# Altium project 19052025_ChanNuoiThongMinh.PrjPcb
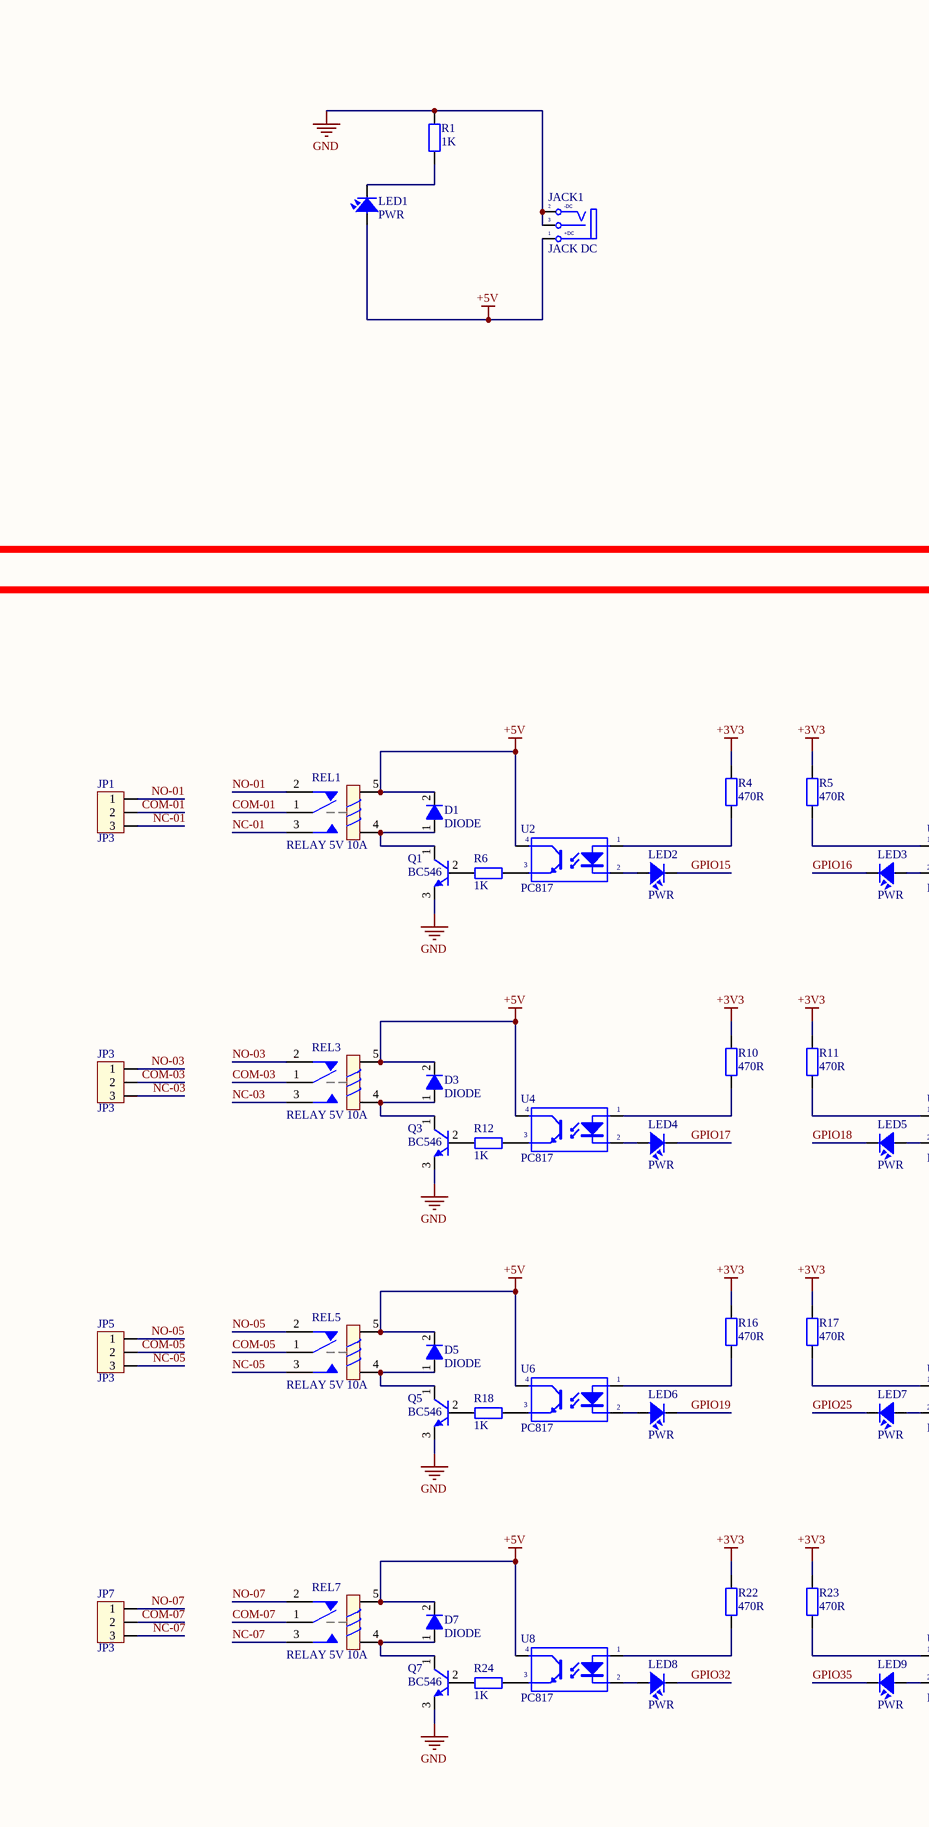
[diagram p0: Schematic_ver01.SchDoc, left]
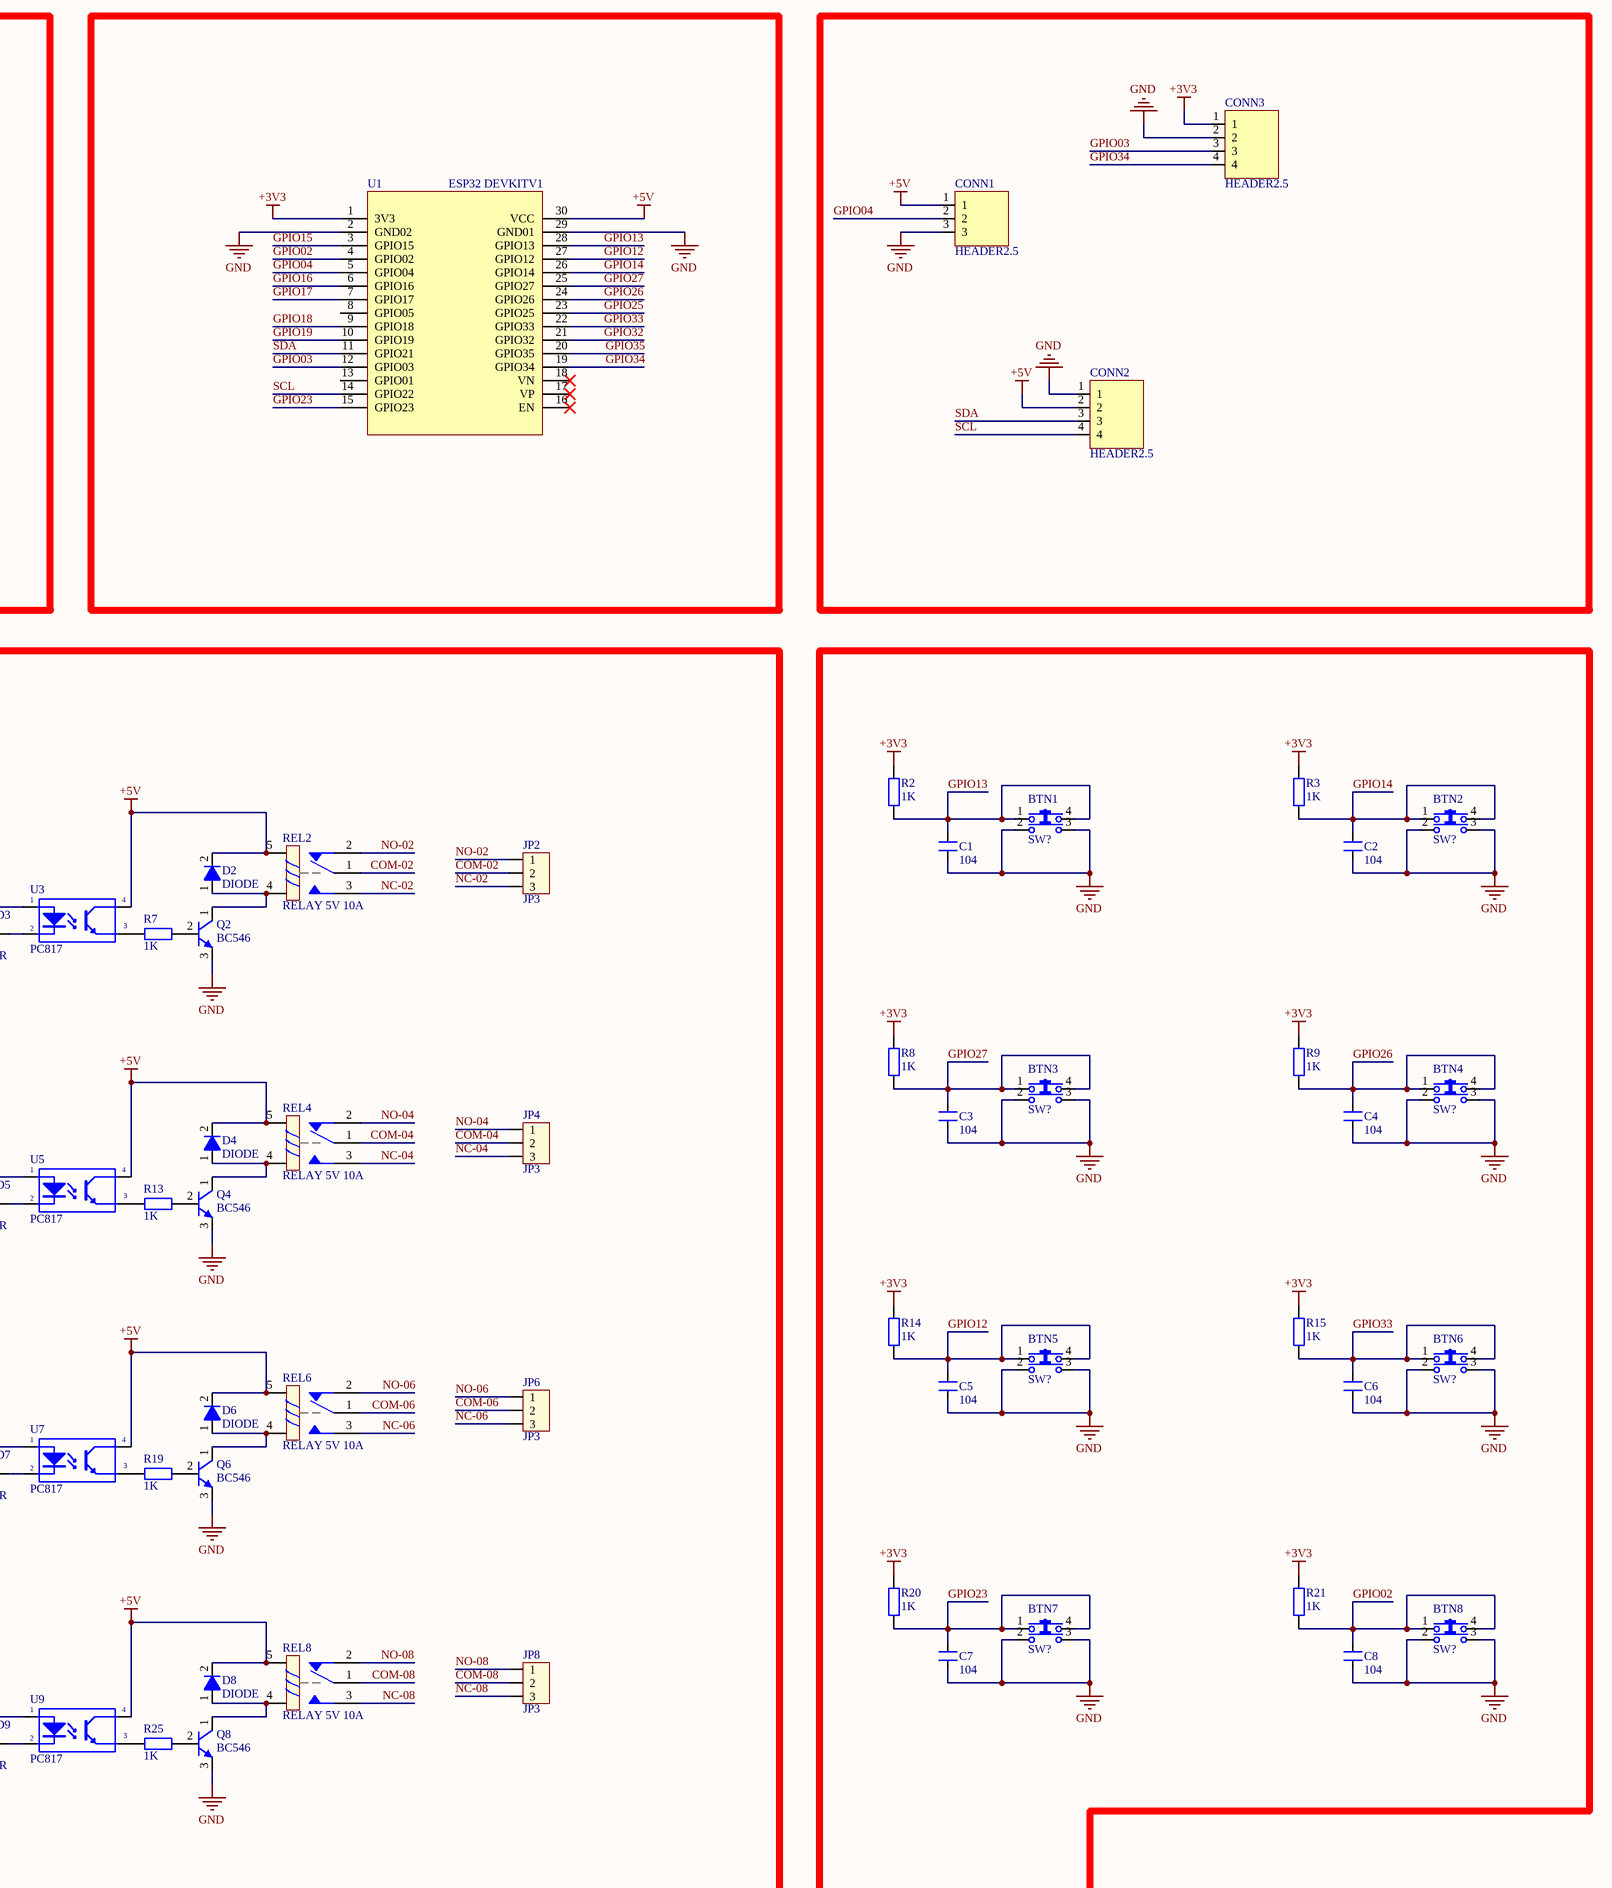
[diagram p1: Schematic_ver01.SchDoc, right]
1 sheet, 95 parts. Net scope: global (net labels, ports and power ports of the same name join across sheets).
Board file: PCB_ver01.PcbDoc

## Sheet Schematic_ver01.SchDoc
size C; SheetNumber: 1; SheetTotal: 1

### Parts
BTN1  SW?  [SW-4P-S]
BTN2  SW?  [SW-4P-S]
BTN3  SW?  [SW-4P-S]
BTN4  SW?  [SW-4P-S]
BTN5  SW?  [SW-4P-S]
BTN6  SW?  [SW-4P-S]
BTN7  SW?  [SW-4P-S]
BTN8  SW?  [SW-4P-S]
C1  104  [0805 CAP]
C2  104  [0805 CAP]
C3  104  [0805 CAP]
C4  104  [0805 CAP]
C5  104  [0805 CAP]
C6  104  [0805 CAP]
C7  104  [0805 CAP]
C8  104  [0805 CAP]
CONN1  HEADER2.5  [CONN3]
CONN2  HEADER2.5  [CONN4]
CONN3  HEADER2.5  [CONN4]
D1  DIODE  [SOD-123]
D2  DIODE  [SOD-123]
D3  DIODE  [SOD-123]
D4  DIODE  [SOD-123]
D5  DIODE  [SOD-123]
D6  DIODE  [SOD-123]
D7  DIODE  [SOD-123]
D8  DIODE  [SOD-123]
JACK1  JACK DC  [JACK-DC]
JP1  JP3  [HED3]
JP2  JP3  [HED3]
JP3  JP3  [HED3]
JP4  JP3  [HED3]
JP5  JP3  [HED3]
JP6  JP3  [HED3]
JP7  JP3  [HED3]
JP8  JP3  [HED3]
LED1  PWR  [0805 LED]
LED2  PWR  [0805 LED]
LED3  PWR  [0805 LED]
LED4  PWR  [0805 LED]
LED5  PWR  [0805 LED]
LED6  PWR  [0805 LED]
LED7  PWR  [0805 LED]
LED8  PWR  [0805 LED]
LED9  PWR  [0805 LED]
Q1  BC546  [TO92]
Q2  BC546  [TO92]
Q3  BC546  [TO92]
Q4  BC546  [TO92]
Q5  BC546  [TO92]
Q6  BC546  [TO92]
Q7  BC546  [TO92]
Q8  BC546  [TO92]
R1  1K  [0805 RESISTOR]
R2  1K  [0805 RESISTOR]
R3  1K  [0805 RESISTOR]
R4  470R  [0805 RESISTOR]
R5  470R  [0805 RESISTOR]
R6  1K  [0805 RESISTOR]
R7  1K  [0805 RESISTOR]
R8  1K  [0805 RESISTOR]
R9  1K  [0805 RESISTOR]
R10  470R  [0805 RESISTOR]
R11  470R  [0805 RESISTOR]
R12  1K  [0805 RESISTOR]
R13  1K  [0805 RESISTOR]
R14  1K  [0805 RESISTOR]
R15  1K  [0805 RESISTOR]
R16  470R  [0805 RESISTOR]
R17  470R  [0805 RESISTOR]
R18  1K  [0805 RESISTOR]
R19  1K  [0805 RESISTOR]
R20  1K  [0805 RESISTOR]
R21  1K  [0805 RESISTOR]
R22  470R  [0805 RESISTOR]
R23  470R  [0805 RESISTOR]
R24  1K  [0805 RESISTOR]
R25  1K  [0805 RESISTOR]
REL1  RELAY 5V 10A  [RELAY 5V-10A]
REL2  RELAY 5V 10A  [RELAY 5V-10A]
REL3  RELAY 5V 10A  [RELAY 5V-10A]
REL4  RELAY 5V 10A  [RELAY 5V-10A]
REL5  RELAY 5V 10A  [RELAY 5V-10A]
REL6  RELAY 5V 10A  [RELAY 5V-10A]
REL7  RELAY 5V 10A  [RELAY 5V-10A]
REL8  RELAY 5V 10A  [RELAY 5V-10A]
U1  ESP32 DEVKITV1  [ESP32-PIN]
U2  PC817  [DIP4/W0.3]
U3  PC817  [DIP4/W0.3]
U4  PC817  [DIP4/W0.3]
U5  PC817  [DIP4/W0.3]
U6  PC817  [DIP4/W0.3]
U7  PC817  [DIP4/W0.3]
U8  PC817  [DIP4/W0.3]
U9  PC817  [DIP4/W0.3]

### Nets
+3V3: CONN3.1 R2.2 R3.2 R4.2 R5.2 R8.2 R9.2 R10.2 R11.2 R14.2 R15.2 R16.2 R17.2 R20.2 R21.2 R22.2 R23.2 U1.1(3V3)
+5V: CONN1.1 CONN2.2 D1.2(A) D2.2(A) D3.2(A) D4.2(A) D5.2(A) D6.2(A) D7.2(A) D8.2(A) JACK1.1(T) LED1.1 REL1.5 REL2.5 REL3.5 REL4.5 REL5.5 REL6.5 REL7.5 REL8.5 U1.30(VCC) U2.4(C) U3.4(C) U4.4(C) U5.4(C) U6.4(C) U7.4(C) U8.4(C) U9.4(C)
GND: BTN1.2 BTN1.3 BTN2.2 BTN2.3 BTN3.2 BTN3.3 BTN4.2 BTN4.3 BTN5.2 BTN5.3 BTN6.2 BTN6.3 BTN7.2 BTN7.3 BTN8.2 BTN8.3 C1.1 C2.1 C3.1 C4.1 C5.1 C6.1 C7.1 C8.1 CONN1.3 CONN2.1 CONN3.2 JACK1.2(TN) JACK1.3(S) Q1.3(E) Q2.3(E) Q3.3(E) Q4.3(E) Q5.3(E) Q6.3(E) Q7.3(E) Q8.3(E) R1.2 U1.2(GND02) U1.29(GND01)
COM-01: JP1.2 REL1.1
COM-02: JP2.2 REL2.1
COM-03: JP3.2 REL3.1
COM-04: JP4.2 REL4.1
COM-05: JP5.2 REL5.1
COM-06: JP6.2 REL6.1
COM-07: JP7.2 REL7.1
COM-08: JP8.2 REL8.1
GPIO02: BTN8.1 BTN8.4 C8.2 R21.1 U1.4(GPIO02)
GPIO03: CONN3.3 U1.12(GPIO03)
GPIO04: CONN1.2 U1.5(GPIO04)
GPIO12: BTN5.1 BTN5.4 C5.2 R14.1 U1.27(GPIO12)
GPIO13: BTN1.1 BTN1.4 C1.2 R2.1 U1.28(GPIO13)
GPIO14: BTN2.1 BTN2.4 C2.2 R3.1 U1.26(GPIO14)
GPIO15: LED2.2 U1.3(GPIO15)
GPIO16: LED3.2 U1.6(GPIO16)
GPIO17: LED4.2 U1.7(GPIO17)
GPIO18: LED5.2 U1.9(GPIO18)
GPIO19: LED6.2 U1.10(GPIO19)
GPIO23: BTN7.1 BTN7.4 C7.2 R20.1 U1.15(GPIO23)
GPIO25: LED7.2 U1.23(GPIO25)
GPIO26: BTN4.1 BTN4.4 C4.2 R9.1 U1.24(GPIO26)
GPIO27: BTN3.1 BTN3.4 C3.2 R8.1 U1.25(GPIO27)
GPIO32: LED8.2 U1.21(GPIO32)
GPIO33: BTN6.1 BTN6.4 C6.2 R15.1 U1.22(GPIO33)
GPIO34: CONN3.4 U1.19(GPIO34)
GPIO35: LED9.2 U1.20(GPIO35)
NC-01: JP1.3 REL1.3
NC-02: JP2.3 REL2.3
NC-03: JP3.3 REL3.3
NC-04: JP4.3 REL4.3
NC-05: JP5.3 REL5.3
NC-06: JP6.3 REL6.3
NC-07: JP7.3 REL7.3
NC-08: JP8.3 REL8.3
NO-01: JP1.1 REL1.2
NO-02: JP2.1 REL2.2
NO-03: JP3.1 REL3.2
NO-04: JP4.1 REL4.2
NO-05: JP5.1 REL5.2
NO-06: JP6.1 REL6.2
NO-07: JP7.1 REL7.2
NO-08: JP8.1 REL8.2
SCL: CONN2.4 U1.14(GPIO22)
SDA: CONN2.3 U1.11(GPIO21)
NetD1_1: D1.1(A) Q1.1(C) REL1.4
NetD2_1: D2.1(A) Q2.1(C) REL2.4
NetD3_1: D3.1(A) Q3.1(C) REL3.4
NetD4_1: D4.1(A) Q4.1(C) REL4.4
NetD5_1: D5.1(A) Q5.1(C) REL5.4
NetD6_1: D6.1(A) Q6.1(C) REL6.4
NetD7_1: D7.1(A) Q7.1(C) REL7.4
NetD8_1: D8.1(A) Q8.1(C) REL8.4
NetLED1_2: LED1.2 R1.1
NetLED2_1: LED2.1 U2.2(K)
NetLED3_1: LED3.1 U3.2(K)
NetLED4_1: LED4.1 U4.2(K)
NetLED5_1: LED5.1 U5.2(K)
NetLED6_1: LED6.1 U6.2(K)
NetLED7_1: LED7.1 U7.2(K)
NetLED8_1: LED8.1 U8.2(K)
NetLED9_1: LED9.1 U9.2(K)
NetQ1_2: Q1.2(B) R6.2
NetQ2_2: Q2.2(B) R7.2
NetQ3_2: Q3.2(B) R12.2
NetQ4_2: Q4.2(B) R13.2
NetQ5_2: Q5.2(B) R18.2
NetQ6_2: Q6.2(B) R19.2
NetQ7_2: Q7.2(B) R24.2
NetQ8_2: Q8.2(B) R25.2
NetR4_1: R4.1 U2.1(A)
NetR5_1: R5.1 U3.1(A)
NetR6_1: R6.1 U2.3(E)
NetR7_1: R7.1 U3.3(E)
NetR10_1: R10.1 U4.1(A)
NetR11_1: R11.1 U5.1(A)
NetR12_1: R12.1 U4.3(E)
NetR13_1: R13.1 U5.3(E)
NetR16_1: R16.1 U6.1(A)
NetR17_1: R17.1 U7.1(A)
NetR18_1: R18.1 U6.3(E)
NetR19_1: R19.1 U7.3(E)
NetR22_1: R22.1 U8.1(A)
NetR23_1: R23.1 U9.1(A)
NetR24_1: R24.1 U8.3(E)
NetR25_1: R25.1 U9.3(E)

Not connected (* = marked no-connect by the designer): U1 8(GPIO05) 13(GPIO01) 16(EN)* 17(VP)* 18(VN)*

### Notes on the sheet
- (in symbol JACK DC) -DC; +DC

### Library data of the parts
BTN1-BTN8 = button-4
C1-C8 = CAP CERAMIC
CONN1 = B3B-XH-A: CONN HEADER VERT 3POS 2.5MM
CONN2 CONN3 = B4B-XH-A: CONN HEADER VERT 4POS 2.5MM
JACK1 = JACK DC: Value: Jac DC
JP1-JP8 = CON3: Connector 3; Value: Connector 3
LED1-LED9 = LED: Single color LED; Value: PWR
Q1-Q8 = BC547: TRANS NPN 45V 0.1A TO-92-3
R1-R25 = RESISTOR: Value: R1/4W - 1K
U2-U9 = PC817: Single Opto; Value: PC817